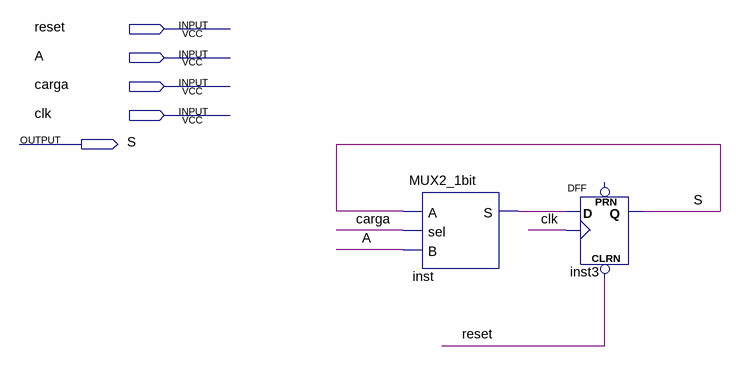
[diagram p0: schematic sheet]
// Quartus schematic RegCargaParalela_1bit.bdf as structural Verilog: 2 symbols, 5 pins
module RegCargaParalela_1bit (
  input  reset,
  input  A,
  input  carga,
  input  clk,
  output S
);

  wire inst_s;

  MUX2_1bit inst (.A(S), .sel(carga), .B(A), .S(inst_s));
  DFF inst3 (.CLRN(reset), .CLK(clk), .D(inst_s), .Q(S));  // open: PRN
endmodule
